# EAGLE design Precision Adder (EAGLE 9.6.2)
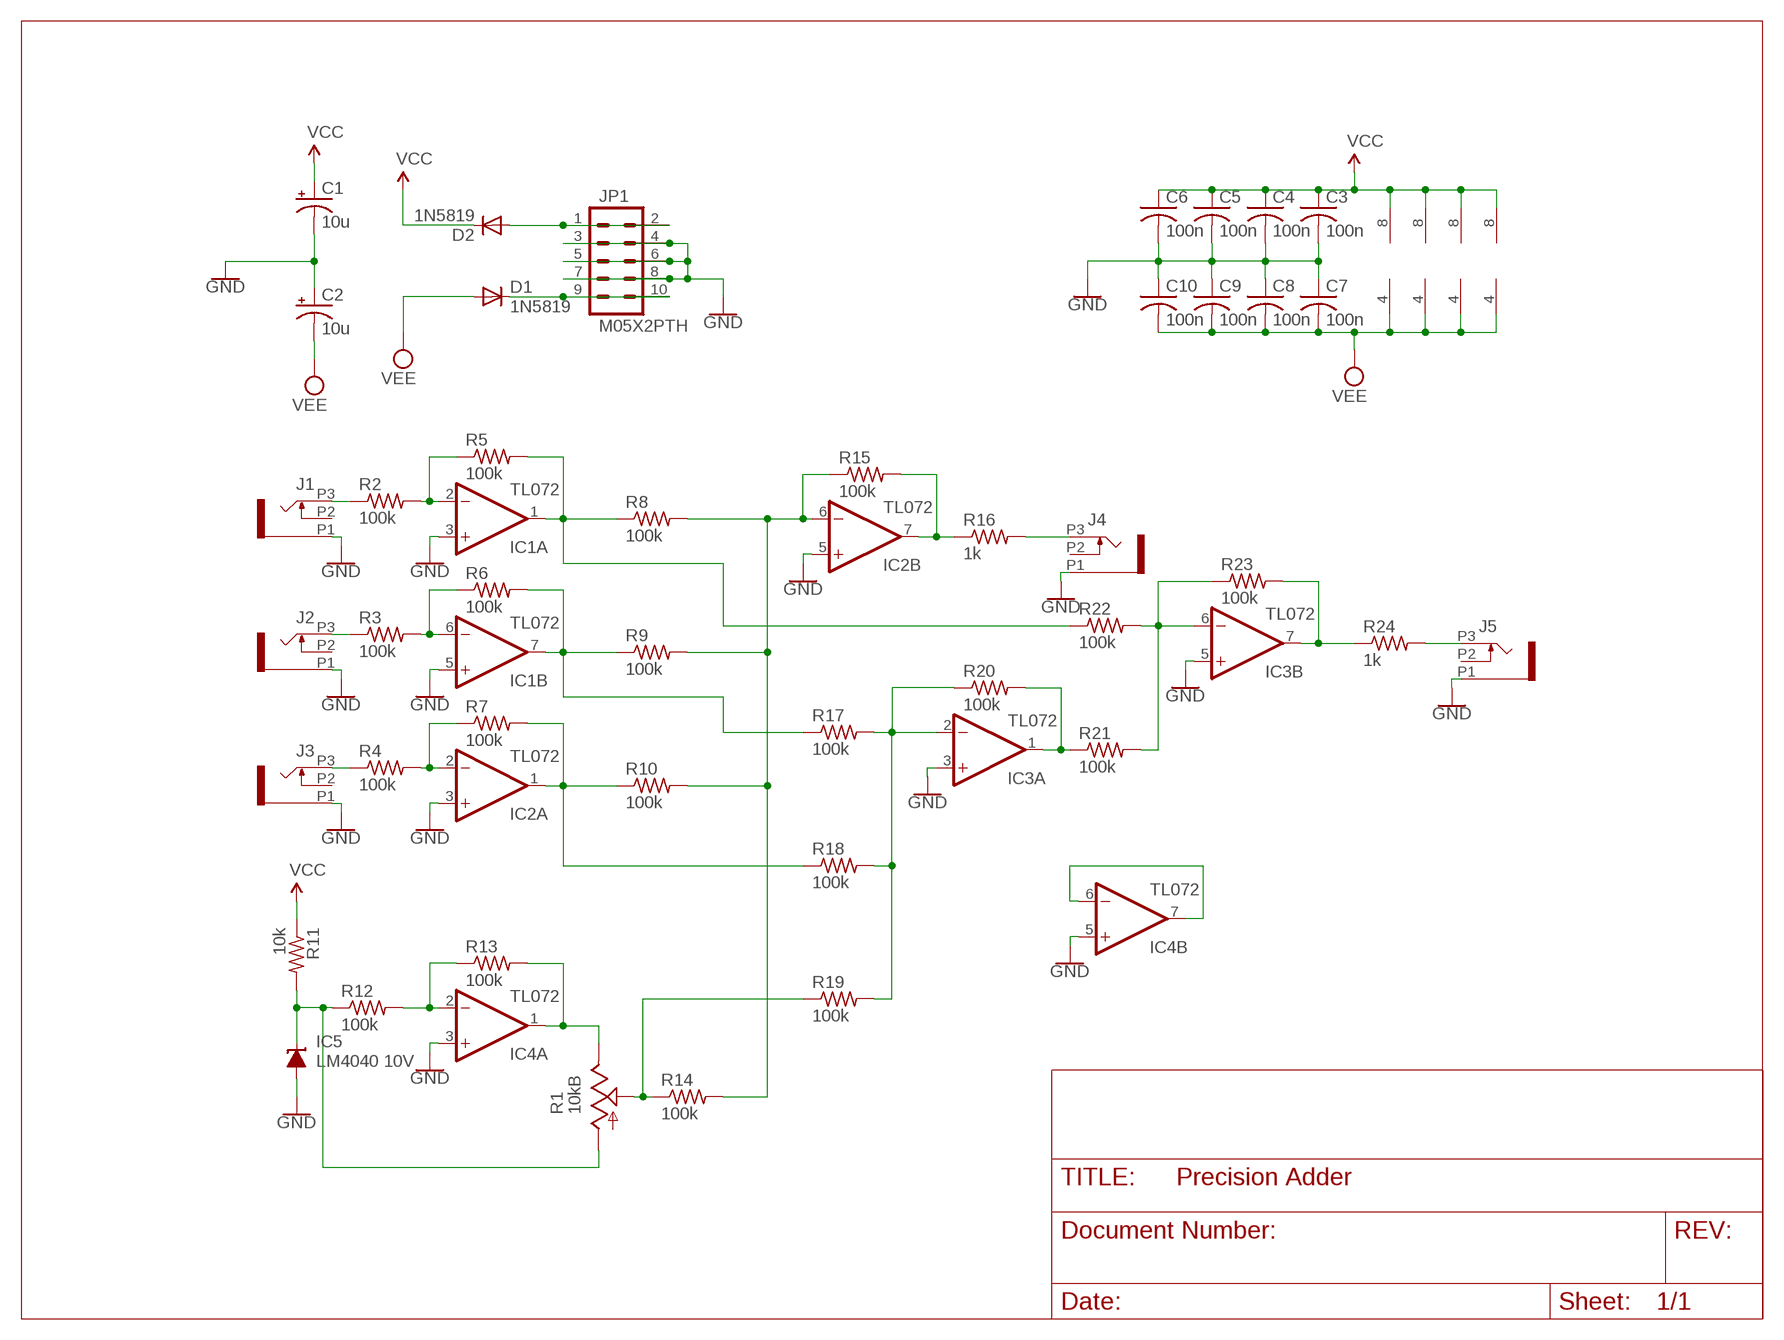
[diagram p0: schematic, sheet 1]

## Parts
C1  10u  RCL_CPOL-USB  [RCL_PANASONIC_B]
C2  10u  RCL_CPOL-USB  [RCL_PANASONIC_B]
C3  100n  RCL_C-USC0603  [RCL_C0603]
C4  100n  RCL_C-USC0603  [RCL_C0603]
C5  100n  RCL_C-USC0603  [RCL_C0603]
C6  100n  RCL_C-USC0603  [RCL_C0603]
C7  100n  RCL_C-USC0603  [RCL_C0603]
C8  100n  RCL_C-USC0603  [RCL_C0603]
C9  100n  RCL_C-USC0603  [RCL_C0603]
C10  100n  RCL_C-USC0603  [RCL_C0603]
D1  1N5819  DIODE_DIODE-SOD123  [DIODE_SOD123]
D2  1N5819  DIODE_DIODE-SOD123  [DIODE_SOD123]
IC1  TL072  GM-ICS_TL072D  [GM-ICS_SO08]
IC2  TL072  GM-ICS_TL072D  [GM-ICS_SO08]
IC3  TL072  GM-ICS_TL072D  [GM-ICS_SO08]
IC4  TL072  GM-ICS_TL072D  [GM-ICS_SO08]
IC5  LM4040 10V  TEXAS_LM4041A12DBZ  [TEXAS_DBZ_R-PDSO-G3]
J1  OG-PJ301_PJ301_THONKICONN6  [OG-PJ301_WQP_PJ_301M6]
J2  OG-PJ301_PJ301_THONKICONN6  [OG-PJ301_WQP_PJ_301M6]
J3  OG-PJ301_PJ301_THONKICONN6  [OG-PJ301_WQP_PJ_301M6]
J4  OG-PJ301_PJ301_THONKICONN6  [OG-PJ301_WQP_PJ_301M6]
J5  OG-PJ301_PJ301_THONKICONN6  [OG-PJ301_WQP_PJ_301M6]
JP1  M05X2PTH  OG-HEADER_M05X2PTH  [OG-HEADER_AVR_ICSP]
R1  10kB  POT-ALPS_POT_USVERTICAL_PS  [POT-ALPS_ALPS_POT_VERTICAL_PS]
R2  100k  RESISTOR_R-US_R0603  [RESISTOR_R0603]
R3  100k  RESISTOR_R-US_R0603  [RESISTOR_R0603]
R4  100k  RESISTOR_R-US_R0603  [RESISTOR_R0603]
R5  100k  RESISTOR_R-US_R0603  [RESISTOR_R0603]
R6  100k  RESISTOR_R-US_R0603  [RESISTOR_R0603]
R7  100k  RESISTOR_R-US_R0603  [RESISTOR_R0603]
R8  100k  RESISTOR_R-US_R0603  [RESISTOR_R0603]
R9  100k  RESISTOR_R-US_R0603  [RESISTOR_R0603]
R10  100k  RESISTOR_R-US_R0603  [RESISTOR_R0603]
R11  10k  RESISTOR_R-US_R0603  [RESISTOR_R0603]
R12  100k  RESISTOR_R-US_R0603  [RESISTOR_R0603]
R13  100k  RESISTOR_R-US_R0603  [RESISTOR_R0603]
R14  100k  RESISTOR_R-US_R0603  [RESISTOR_R0603]
R15  100k  RESISTOR_R-US_R0603  [RESISTOR_R0603]
R16  1k  RESISTOR_R-US_R0603  [RESISTOR_R0603]
R17  100k  RESISTOR_R-US_R0603  [RESISTOR_R0603]
R18  100k  RESISTOR_R-US_R0603  [RESISTOR_R0603]
R19  100k  RESISTOR_R-US_R0603  [RESISTOR_R0603]
R20  100k  RESISTOR_R-US_R0603  [RESISTOR_R0603]
R21  100k  RESISTOR_R-US_R0603  [RESISTOR_R0603]
R22  100k  RESISTOR_R-US_R0603  [RESISTOR_R0603]
R23  100k  RESISTOR_R-US_R0603  [RESISTOR_R0603]
R24  1k  RESISTOR_R-US_R0603  [RESISTOR_R0603]

## Nets
GND: C1.- C2.+ C3.2 C4.2 C5.2 C6.2 C7.1 C8.1 C9.1 C10.1 IC1.3(A:+IN) IC1.5(B:+IN) IC2.3(A:+IN) IC2.5(B:+IN) IC3.3(A:+IN) IC3.5(B:+IN) IC4.3(A:+IN) IC4.5(B:+IN) IC5.2(A) J1.P1 J2.P1 J3.P1 J4.P1 J5.P1 JP1.3 JP1.4 JP1.5 JP1.6 JP1.7 JP1.8
N$1: D2.A JP1.1 JP1.2
N$2: J1.P3 R2.1
N$3: IC1.2(A:-IN) R2.2 R5.1
N$4: IC1.1(A:OUT) R5.2 R8.1 R22.1
N$5: D1.C JP1.9 JP1.10
N$6: J2.P3 R3.1
N$7: IC1.6(B:-IN) R3.2 R6.1
N$8: IC1.7(B:OUT) R6.2 R9.1 R17.1
N$9: IC2.1(A:OUT) R7.2 R10.1 R18.1
N$10: IC2.2(A:-IN) R4.2 R7.1
N$11: J3.P3 R4.1
N$12: IC5.1(C) R1.P$3(A) R11.2 R12.1
N$13: IC4.2(A:-IN) R12.2 R13.1
N$14: IC4.1(A:OUT) R1.P$1(E) R13.2
N$15: IC4.6(B:-IN) IC4.7(B:OUT)
N$16: IC2.6(B:-IN) R8.2 R9.2 R10.2 R14.2 R15.1
N$17: R1.P$2(S) R14.1 R19.1
N$18: IC2.7(B:OUT) R15.2 R16.1
N$19: J4.P3 R16.2
N$20: IC3.2(A:-IN) R17.2 R18.2 R19.2 R20.1
N$21: IC3.1(A:OUT) R20.2 R21.1
N$22: IC3.6(B:-IN) R21.2 R22.2 R23.1
N$23: IC3.7(B:OUT) R23.2 R24.1
N$24: J5.P3 R24.2
VCC: C1.+ C3.1 C4.1 C5.1 C6.1 D2.C IC1.8(P:V+) IC2.8(P:V+) IC3.8(P:V+) IC4.8(P:V+) R11.1
VEE: C2.- C7.2 C8.2 C9.2 C10.2 D1.A IC1.4(P:V-) IC2.4(P:V-) IC3.4(P:V-) IC4.4(P:V-)
Unconnected: J1.P2 J2.P2 J3.P2 J4.P2 J5.P2

## Library data of the parts
C1 C2 = my-library:RCL_CPOL-US: POLARIZED CAPACITOR, American symbol
C3-C10 = my-library:RCL_C-US: CAPACITOR, American symbol
D1 D2 = my-library:DIODE_DIODE-: DIODE
IC1-IC4 = my-library:GM-ICS_TL072: OP AMP
IC5 = my-library:TEXAS_LM4041: PRECISION MICROPOWER SHUNT VOLTAGE REFERENCE Source: http://focus.ti.com/lit/ds/slcs146e/slcs146e.pdf
J1-J5 = my-library:OG-PJ301_PJ301_THONKICONN
JP1 = my-library:OG-HEADER_M05X2: Header 5x2 Standard 10-pin dual row 0.1" header. Commonly used with AVR-ISP. Use with Spark Fun Electronics SKU: PRT-00778
R1 = my-library:POT-ALPS_POT_US
R2-R24 = my-library:RESISTOR_R-US_: RESISTOR, American symbol

## Board
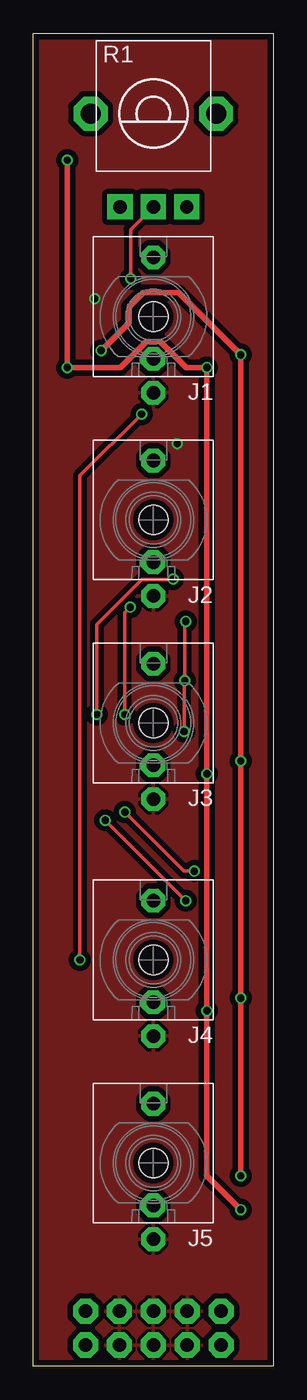
[diagram p1: board, top side]
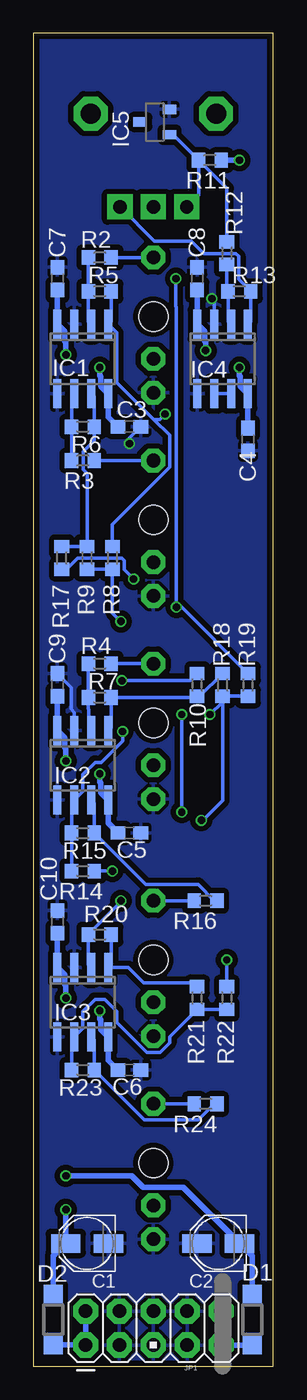
[diagram p2: board, bottom side, seen from below]

Size 18 x 100 mm. Coordinates in mm from the lower left corner, seen from the top.
Outline: 0,0 0,100 18,100 18,0 0,0
Copper layers (1*16): Top 0.035559375mm / dielectric 1.6mm / Bottom 0.035559375mm
Design rules "jlcpcb2layer": minimum track width 5mil, minimum drill 12mil, track to track 5mil, track to pad 5mil, pad to pad 5mil, via to via 5mil, smd to smd 5mil, copper to edge 8mil, drill to drill 6mil, minimum pad ring 5mil, minimum via ring 3mil, stop-mask expansion 2.5mil, vias tented up to drill 0mil, thermal gap 10mil

### Footprints (pad centres in the part's own frame; a part is rotated, then mirrored left to right if it is on the bottom)
RCL_PANASONIC_B = smd 2.2 x 1.4: + 1.6,0; - -1.6,0
RCL_C0603 = smd 1.1 x 1: 1 -0.85,0; 2 0.85,0
DIODE_SOD123 = smd 1.4 x 1.4: A 1.9,0; C -1.9,0
GM-ICS_SO08 = smd 0.6 x 2.2: 1 -1.905,-2.6; 2 -0.635,-2.6; 3 0.635,-2.6; 4 1.905,-2.6; 5 1.905,2.6; 6 0.635,2.6; 7 -0.635,2.6; 8 -1.905,2.6
TEXAS_DBZ_R-PDSO-G3 = smd 0.7 x 1: 1 -0.95,-1.1; 2 0.95,-1.1; 3 0,1.1
OG-PJ301_WQP_PJ_301M6 = drill 1.016 pad 1.778 octagon: P1 0,-5.715; P2 0,-3.175; P3 0,4.445 | hole 2.2: 0,0
OG-HEADER_AVR_ICSP = drill 1.016 pad 1.88 octagon: 1 -1.27,5.08; 2 1.27,5.08; 3 -1.27,2.54; 4 1.27,2.54; 5 -1.27,0; 6 1.27,0; 7 -1.27,-2.54; 8 1.27,-2.54; 9 -1.27,-5.08; 10 1.27,-5.08
POT-ALPS_ALPS_POT_VERTICAL_PS = drill 1 pad 1.88 square: P$1 -2.5,7; P$2 0,7; P$3 2.5,7 | drill 1.5 pad 2.54 octagon: P$4 -4.7,0; P$5 4.7,0
RESISTOR_R0603 = smd 1 x 1.1: 1 -0.85,0; 2 0.85,0

### Placement (x,y rotation side)
C1  13.97,9.21 180 bottom
C2  4.13,9.21 180 bottom
C3  10.79,70.48 0 bottom
C4  1.91,69.53 270 bottom
C5  10.79,40.01 0 bottom
C6  10.79,22.23 0 bottom
C7  16.19,81.6 270 bottom
C8  5.71,81.6 270 bottom
C9  16.19,51.12 270 bottom
C10  16.19,33.34 270 bottom
D1  1.59,3.49 90 bottom
D2  16.51,3.49 270 bottom
IC1  14.29,75.56 180 bottom
IC2  14.29,45.09 180 bottom
IC3  14.29,27.3 180 bottom
IC4  3.81,75.56 180 bottom
IC5  8.89,93.34 90 bottom
J1  9,78.74 0 top
J2  9,63.5 0 top
J3  9,48.26 0 top
J4  9,30.48 0 top
J5  9,15.24 0 top
JP1  9,2.86 90 bottom
R1  9,93.98 180 top
R2  13.02,83.19 180 bottom
R3  14.29,67.94 180 bottom
R4  13.02,52.7 180 bottom
R5  13.02,80.64 0 bottom
R6  14.29,70.48 0 bottom
R7  13.02,50.16 0 bottom
R8  12.06,60.64 270 bottom
R9  13.97,60.64 270 bottom
R10  5.71,51.12 90 bottom
R11  4.76,90.49 180 bottom
R12  3.49,83.5 270 bottom
R13  2.54,80.64 0 bottom
R14  14.29,37.15 180 bottom
R15  14.29,40.01 0 bottom
R16  5.08,34.92 180 bottom
R17  15.88,60.64 270 bottom
R18  3.81,51.12 270 bottom
R19  1.91,51.12 270 bottom
R20  13.02,32.38 0 bottom
R21  5.71,27.62 270 bottom
R22  3.49,27.62 270 bottom
R23  14.29,22.23 0 bottom
R24  5.08,19.68 180 bottom

### Tracks (layer width: path | path; a pad name or v marks a point on that pad's centre or on a via)
GND  (via drill 0.55)
  Bottom 0.254: IC4.3 4.45,79.93 v4.6,80.09 | IC2.3 14.92,49.06 15.15,49.29 15.15,50.93 C9.1 | C3.2 10.79,69.64 v10.79,69.22
  pour Bottom (isolate 0.406): -1.27,-1.27 19.05,-1.27 19.05,101.6 -0.95,101.6 -1.27,101.28
  pour Top (isolate 0.406): 19.05,101.6 -1.27,101.6 -1.27,-1.27 19.05,-1.27
N$1
  Bottom 0.406: JP1.2 JP1.1 D2.A
N$2
  Bottom 0.254: R2.1 J1.P3
N$3
  Bottom 0.254: R2.2 R5.1 13.87,78.38 IC1.2
N$4  (via drill 0.55)
  Top 0.254: v8.12,71.44 3.49,66.81 v3.49,30.48
  Bottom 0.254: R5.2 12.17,78.38 IC1.1 11.75,77.53 11.75,73.81 8.98,71.03 | R8.1 12.06,63.16 7.78,67.44 7.78,69.84 8.98,71.03 | 8.98,71.03 8.53,71.03 v8.12,71.44 | v3.49,30.48 R22.1
N$5
  Bottom 0.406: JP1.10 JP1.9 D1.C
N$6
  Bottom 0.254: R3.1 J2.P3
N$7
  Bottom 0.254: IC1.6 15.14,72.75 R6.1 R3.2
N$8
  Bottom 0.254: IC1.7 13.44,72.75 R6.2 13.44,69.46 14.27,68.63 14.27,67.26 13.97,66.96 R9.1 R17.1
N$9
  Bottom 0.254: IC2.1 12.17,47.9 R7.2 5.82,50.16 R10.1 5.51,50.27 R18.1
N$10
  Bottom 0.254: IC2.2 13.84,47.87 13.84,49.26 13.87,49.3 R7.1 R4.2
N$11
  Bottom 0.254: R4.1 J3.P3
N$12
  Bottom 0.254: R11.2 7.52,92.39 IC5.1 | R11.2 5.61,87.87 R1.P$3 | R12.1 3.49,88.37 R11.2
N$13
  Bottom 0.254: R12.2 3.49,80.75 R13.1 3.39,78.38 IC4.2
N$14
  Bottom 0.254: IC4.1 1.69,78.38 R13.2 2.61,81.57 2.61,83.29 2.81,83.48 5.23,83.48 6.16,84.4 8.92,84.4 R1.P$1
N$15
  Bottom 0.254: IC4.6 IC4.7
N$16  (via drill 0.55)
  Top 0.254: v11.31,47.62 11.31,51.39 v11.35,51.44 11.35,55.8 v11.43,55.88
  Bottom 0.254: R9.2 R8.2 12.06,56.52 v11.43,55.88 | v11.31,47.62 11.31,46.89 12.89,45.31 13.37,45.31 14.28,44.4 14.28,43.12 IC2.6 15.14,42.27 R15.1 R14.2 | R10.2 6.25,51.44 v11.35,51.44
N$17  (via drill 0.55)
  Top 0.254: R1.P$2 7.3,85.28 v7.3,81.6 | v6.86,48.9 6.86,56.54 v7.26,56.94 | v12.06,37.15 11.29,37.15 v6.86,41.57
  Bottom 0.254: v7.3,81.6 7.3,79.5 7.26,79.46 v7.26,56.94 6.88,56.94 R19.1 | v6.86,41.57 v6.86,48.9 | R14.1 v12.06,37.15
N$18
  Bottom 0.254: IC2.7 13.44,42.27 R15.2 9.58,36.14 5.63,36.14 4.41,34.92 R16.1
N$19
  Bottom 0.254: J4.P3 R16.2
N$20  (via drill 0.55)
  Top 0.254: v11.43,34.92 v5.4,40.96 | v10.48,59.05 10.43,59 8.12,59 4.76,55.65 v4.76,48.9
  Bottom 0.254: R18.2 3.81,42.44 5.29,40.96 v5.4,40.96 | IC3.2 13.87,30.12 R20.1 11.43,34.82 v11.43,34.92 | R18.2 R19.2 | v10.48,59.05 11.19,59.76 11.19,60.43 11.38,60.62 14.66,60.62 15.49,59.79 R17.2 | v4.76,48.9 3.81,49.85 R18.2
N$21
  Bottom 0.254: R20.2 12.17,30.12 IC3.1 10.88,29.91 9.72,28.75 5.99,28.75 R21.1
N$22
  Bottom 0.254: R22.2 R21.2 7.78,24.71 7.78,24.26 8.49,23.55 9.51,23.55 11.75,25.79 11.75,26.62 12.66,27.53 13.37,27.53 14.28,26.62 14.28,25.34 IC3.6 15.14,24.49 R23.1
N$23
  Bottom 0.254: IC3.7 13.44,24.49 R23.2 9.68,18.47 5.63,18.47 4.41,19.68 R24.1
N$24
  Bottom 0.254: R24.2 J5.P3
VCC  (via drill 0.55)
  Top 0.406: v15.56,11.75 13.02,14.29 v13.02,26.67 v13.02,44.45 v13.02,74.93 11.47,74.93 9.54,76.86 8.46,76.86 6.53,74.93 v2.54,74.93 v2.54,90.49
  Bottom 0.406: D2.C 16.51,8.27 C1.+ 15.57,11.73 v15.56,11.75 | v13.02,26.67 13.02,26.05 12.95,25.97 12.95,25.27 IC3.8 12.38,22.96 C6.1 | v13.02,44.45 13.02,43.83 12.95,43.75 12.95,43.05 IC2.8 12.38,40.74 C5.1 | v13.02,74.93 13.02,74.31 12.95,74.23 12.95,73.53 IC1.8 12.38,71.22 C3.1 | v2.54,74.93 2.54,74.31 2.47,74.23 2.47,73.53 IC4.8 C4.1 | v2.54,90.49 R11.1
VEE  (via drill 0.55)
  Top 0.406: v15.56,14.29 v15.56,27.62 v15.56,45.4 v15.56,75.88 10.89,80.55 8.25,80.55 7.19,79.49 7.19,78.31 v5.08,76.2
  Bottom 0.406: D1.A 1.59,8.27 C2.- 6.75,13.43 9.75,13.43 10.61,14.29 v15.56,14.29 | v15.56,27.62 15.56,28.57 15.63,28.64 15.63,29.34 IC3.4 C10.2 | v15.56,45.4 15.56,46.34 15.63,46.42 15.63,47.12 IC2.4 C9.2 | v15.56,75.88 15.56,76.83 15.63,76.9 15.63,77.6 IC1.4 C7.2 | v5.08,76.2 5.08,76.83 5.15,76.9 5.15,77.6 IC4.4 C8.2

### Text on the board
bDocu: SoundFlask | 2020 | Precision Adder | Ver. 1.0